# Altium schematic sheet 30_PP0_PWR.SchDoc
size 419 x 296 mm; Author: Serbinov O.A.; CompanyName: ELSICOM; DrawnBy: Serbinov O.A.; Engineer: Serbinov O.A.; Organization: Elsicom; Address1: Kirova avenue, 58; Address2: Tomsk; Address3: Russia 634012; DocumentNumber: 31; SheetNumber: 31; SheetTotal: 44; ProjectName: 48_PORTS
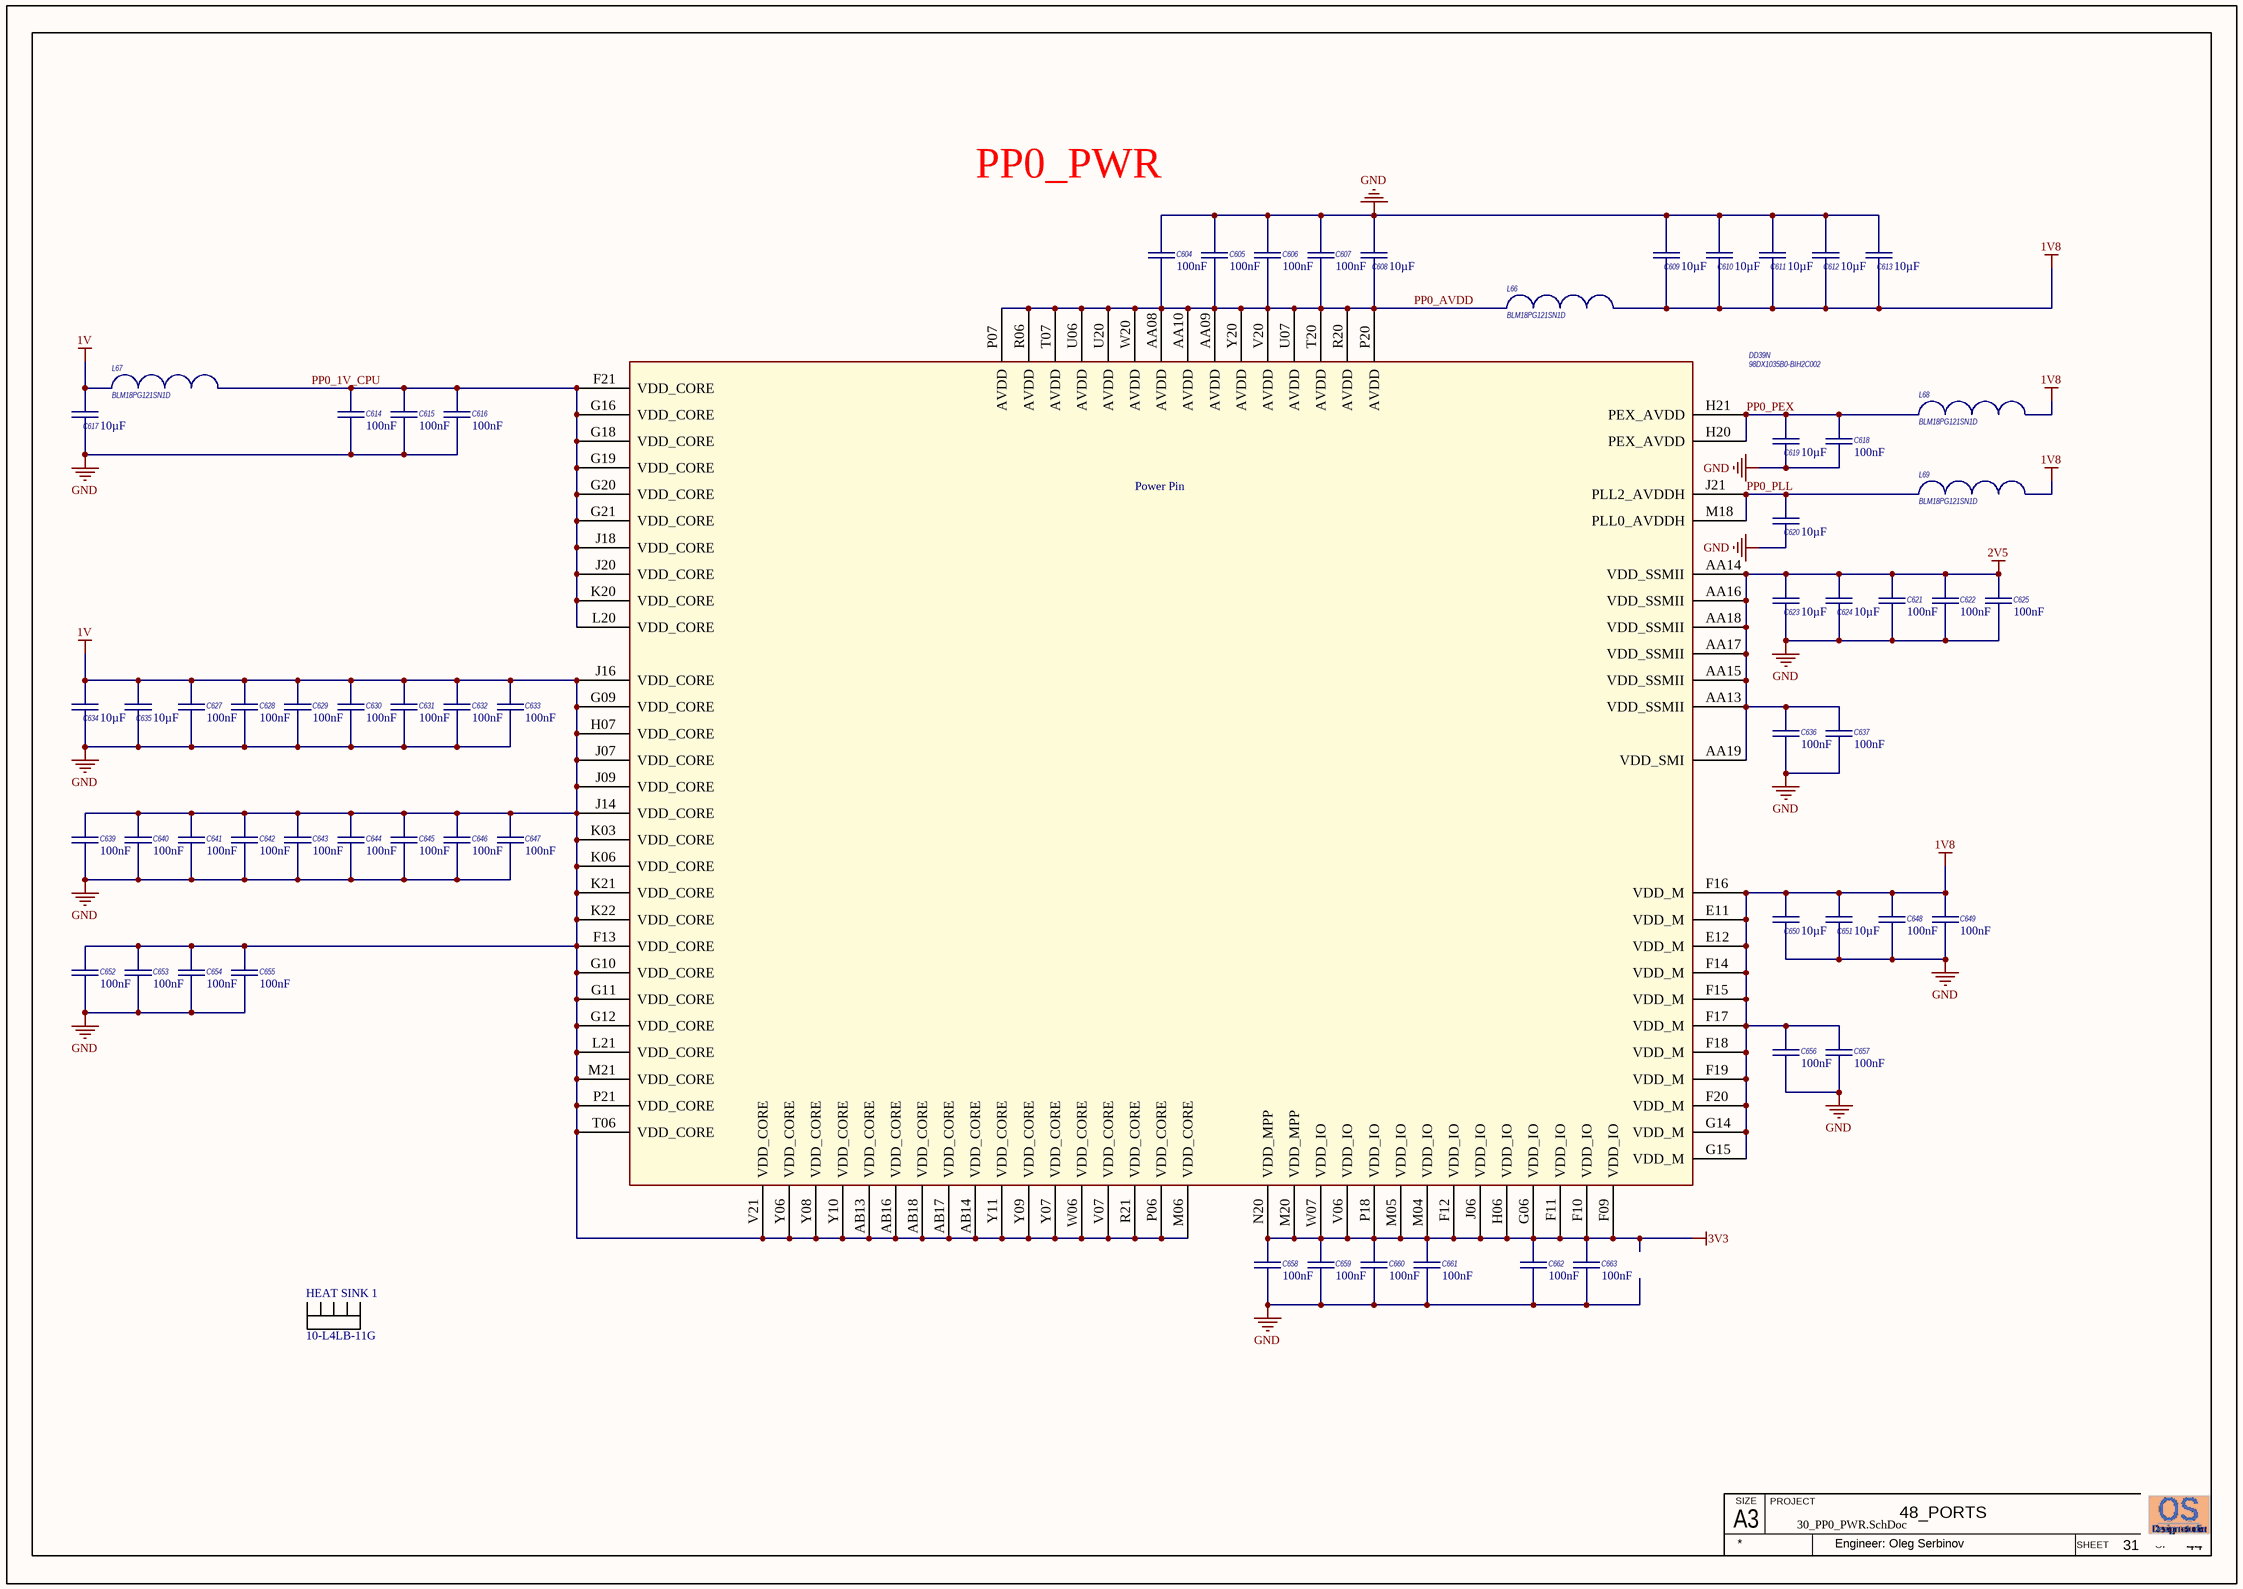
[diagram p0: 30_PP0_PWR.SchDoc]

## Parts
C604  Capacitance: 100nF  [C0402_IPC High Density]  (hidden comment: GRM155R71E104KE14D)
C605  Capacitance: 100nF  [C0402_IPC High Density]  (hidden comment: GRM155R71E104KE14D)
C606  Capacitance: 100nF  [C0402_IPC High Density]  (hidden comment: GRM155R71E104KE14D)
C607  Capacitance: 100nF  [C0402_IPC High Density]  (hidden comment: GRM155R71E104KE14D)
C608  Capacitance: 10µF  [CAPC2012[0805]]  (hidden comment: GRM21BR61C106KE15)
C609  Capacitance: 10µF  [CAPC2012[0805]]  (hidden comment: GRM21BR61C106KE15)
C610  Capacitance: 10µF  [CAPC2012[0805]]  (hidden comment: GRM21BR61C106KE15)
C611  Capacitance: 10µF  [CAPC2012[0805]]  (hidden comment: GRM21BR61C106KE15)
C612  Capacitance: 10µF  [CAPC2012[0805]]  (hidden comment: GRM21BR61C106KE15)
C613  Capacitance: 10µF  [CAPC2012[0805]]  (hidden comment: GRM21BR61C106KE15)
C614  Capacitance: 100nF  [C0402_IPC High Density]  (hidden comment: GRM155R71E104KE14D)
C615  Capacitance: 100nF  [C0402_IPC High Density]  (hidden comment: GRM155R71E104KE14D)
C616  Capacitance: 100nF  [C0402_IPC High Density]  (hidden comment: GRM155R71E104KE14D)
C617  Capacitance: 10µF  [CAPC2012[0805]]  (hidden comment: GRM21BR61C106KE15)
C618  Capacitance: 100nF  [C0402_IPC High Density]  (hidden comment: GRM155R71E104KE14D)
C619  Capacitance: 10µF  [CAPC2012[0805]]  (hidden comment: GRM21BR61C106KE15)
C620  Capacitance: 10µF  [CAPC2012[0805]]  (hidden comment: GRM21BR61C106KE15)
C621  Capacitance: 100nF  [C0402_IPC High Density]  (hidden comment: GRM155R71E104KE14D)
C622  Capacitance: 100nF  [C0402_IPC High Density]  (hidden comment: GRM155R71E104KE14D)
C623  Capacitance: 10µF  [CAPC2012[0805]]  (hidden comment: GRM21BR61C106KE15)
C624  Capacitance: 10µF  [CAPC2012[0805]]  (hidden comment: GRM21BR61C106KE15)
C625  Capacitance: 100nF  [C0402_IPC High Density]  (hidden comment: GRM155R71E104KE14D)
C627  Capacitance: 100nF  [C0402_IPC High Density]  (hidden comment: GRM155R71E104KE14D)
C628  Capacitance: 100nF  [C0402_IPC High Density]  (hidden comment: GRM155R71E104KE14D)
C629  Capacitance: 100nF  [C0402_IPC High Density]  (hidden comment: GRM155R71E104KE14D)
C630  Capacitance: 100nF  [C0402_IPC High Density]  (hidden comment: GRM155R71E104KE14D)
C631  Capacitance: 100nF  [C0402_IPC High Density]  (hidden comment: GRM155R71E104KE14D)
C632  Capacitance: 100nF  [C0402_IPC High Density]  (hidden comment: GRM155R71E104KE14D)
C633  Capacitance: 100nF  [C0402_IPC High Density]  (hidden comment: GRM155R71E104KE14D)
C634  Capacitance: 10µF  [CAPC2012[0805]]  (hidden comment: GRM21BR61C106KE15)
C635  Capacitance: 10µF  [CAPC2012[0805]]  (hidden comment: GRM21BR61C106KE15)
C636  Capacitance: 100nF  [C0402_IPC High Density]  (hidden comment: GRM155R71E104KE14D)
C637  Capacitance: 100nF  [C0402_IPC High Density]  (hidden comment: GRM155R71E104KE14D)
C639  Capacitance: 100nF  [C0402_IPC High Density]  (hidden comment: GRM155R71E104KE14D)
C640  Capacitance: 100nF  [C0402_IPC High Density]  (hidden comment: GRM155R71E104KE14D)
C641  Capacitance: 100nF  [C0402_IPC High Density]  (hidden comment: GRM155R71E104KE14D)
C642  Capacitance: 100nF  [C0402_IPC High Density]  (hidden comment: GRM155R71E104KE14D)
C643  Capacitance: 100nF  [C0402_IPC High Density]  (hidden comment: GRM155R71E104KE14D)
C644  Capacitance: 100nF  [C0402_IPC High Density]  (hidden comment: GRM155R71E104KE14D)
C645  Capacitance: 100nF  [C0402_IPC High Density]  (hidden comment: GRM155R71E104KE14D)
C646  Capacitance: 100nF  [C0402_IPC High Density]  (hidden comment: GRM155R71E104KE14D)
C647  Capacitance: 100nF  [C0402_IPC High Density]  (hidden comment: GRM155R71E104KE14D)
C648  Capacitance: 100nF  [C0402_IPC High Density]  (hidden comment: GRM155R71E104KE14D)
C649  Capacitance: 100nF  [C0402_IPC High Density]  (hidden comment: GRM155R71E104KE14D)
C650  Capacitance: 10µF  [CAPC2012[0805]]  (hidden comment: GRM21BR61C106KE15)
C651  Capacitance: 10µF  [CAPC2012[0805]]  (hidden comment: GRM21BR61C106KE15)
C652  Capacitance: 100nF  [C0402_IPC High Density]  (hidden comment: GRM155R71E104KE14D)
C653  Capacitance: 100nF  [C0402_IPC High Density]  (hidden comment: GRM155R71E104KE14D)
C654  Capacitance: 100nF  [C0402_IPC High Density]  (hidden comment: GRM155R71E104KE14D)
C655  Capacitance: 100nF  [C0402_IPC High Density]  (hidden comment: GRM155R71E104KE14D)
C656  Capacitance: 100nF  [C0402_IPC High Density]  (hidden comment: GRM155R71E104KE14D)
C657  Capacitance: 100nF  [C0402_IPC High Density]  (hidden comment: GRM155R71E104KE14D)
C658  Capacitance: 100nF  [C0402_IPC High Density]  (hidden comment: GRM155R71E104KE14D)
C659  Capacitance: 100nF  [C0402_IPC High Density]  (hidden comment: GRM155R71E104KE14D)
C660  Capacitance: 100nF  [C0402_IPC High Density]  (hidden comment: GRM155R71E104KE14D)
C661  Capacitance: 100nF  [C0402_IPC High Density]  (hidden comment: GRM155R71E104KE14D)
C662  Capacitance: 100nF  [C0402_IPC High Density]  (hidden comment: GRM155R71E104KE14D)
C663  Capacitance: 100nF  [C0402_IPC High Density]  (hidden comment: GRM155R71E104KE14D)
DD39  98DX1035B0-BIH2C002  [HSBGA617_27X27_1MM]  (part N of 16)
HEAT_SINK_1  10-L4LB-11G  [10-L4LB-11G]  (no BOM)
L66  BLM18PG121SN1D  [INDC1608X95N]
L67  BLM18PG121SN1D  [INDC1608X95N]
L68  BLM18PG121SN1D  [INDC1608X95N]
L69  BLM18PG121SN1D  [INDC1608X95N]

## Nets
1V: C617.2 C627.1 C628.1 C629.1 C630.1 C631.1 C632.1 C633.1 C634.2 C635.2 C639.1 C640.1 C641.1 C642.1 C643.1 C644.1 C645.1 C646.1 C647.1 C652.1 C653.1 C654.1 C655.1 DD39.AB13(VDD_CORE) DD39.AB14(VDD_CORE) DD39.AB16(VDD_CORE) DD39.AB17(VDD_CORE) DD39.AB18(VDD_CORE) DD39.F13(VDD_CORE) DD39.G09(VDD_CORE) DD39.G10(VDD_CORE) DD39.G11(VDD_CORE) DD39.G12(VDD_CORE) DD39.H07(VDD_CORE) DD39.J07(VDD_CORE) DD39.J09(VDD_CORE) DD39.J14(VDD_CORE) DD39.J16(VDD_CORE) DD39.K03(VDD_CORE) DD39.K06(VDD_CORE) DD39.K21(VDD_CORE) DD39.K22(VDD_CORE) DD39.L21(VDD_CORE) DD39.M06(VDD_CORE) DD39.M21(VDD_CORE) DD39.P06(VDD_CORE) DD39.P21(VDD_CORE) DD39.R21(VDD_CORE) DD39.T06(VDD_CORE) DD39.V07(VDD_CORE) DD39.V21(VDD_CORE) DD39.W06(VDD_CORE) DD39.Y06(VDD_CORE) DD39.Y07(VDD_CORE) DD39.Y08(VDD_CORE) DD39.Y09(VDD_CORE) DD39.Y10(VDD_CORE) DD39.Y11(VDD_CORE) L67.1
1V8: C609.1 C610.1 C611.1 C612.1 C613.1 C648.1 C649.1 C650.2 C651.2 C656.1 C657.1 DD39.E11(VDD_M) DD39.E12(VDD_M) DD39.F14(VDD_M) DD39.F15(VDD_M) DD39.F16(VDD_M) DD39.F17(VDD_M) DD39.F18(VDD_M) DD39.F19(VDD_M) DD39.F20(VDD_M) DD39.G14(VDD_M) DD39.G15(VDD_M) L66.2 L68.2 L69.2
2V5: C621.1 C622.1 C623.2 C624.2 C625.1 C636.1 C637.1 DD39.AA13(VDD_SSMII) DD39.AA14(VDD_SSMII) DD39.AA15(VDD_SSMII) DD39.AA16(VDD_SSMII) DD39.AA17(VDD_SSMII) DD39.AA18(VDD_SSMII) DD39.AA19(VDD_SMI)
3V3: C658.1 C659.1 C660.1 C661.1 C662.1 C663.1 DD39.F09(VDD_IO) DD39.F10(VDD_IO) DD39.F11(VDD_IO) DD39.F12(VDD_IO) DD39.G06(VDD_IO) DD39.H06(VDD_IO) DD39.J06(VDD_IO) DD39.M04(VDD_IO) DD39.M05(VDD_IO) DD39.M20(VDD_MPP) DD39.N20(VDD_MPP) DD39.P18(VDD_IO) DD39.V06(VDD_IO) DD39.W07(VDD_IO)
GND: C604.1 C605.1 C606.1 C607.1 C608.2 C609.2 C610.2 C611.2 C612.2 C613.2 C614.2 C615.2 C616.2 C617.1 C618.2 C619.1 C620.1 C621.2 C622.2 C623.1 C624.1 C625.2 C627.2 C628.2 C629.2 C630.2 C631.2 C632.2 C633.2 C634.1 C635.1 C636.2 C637.2 C639.2 C640.2 C641.2 C642.2 C643.2 C644.2 C645.2 C646.2 C647.2 C648.2 C649.2 C650.1 C651.1 C652.2 C653.2 C654.2 C655.2 C656.2 C657.2 C658.2 C659.2 C660.2 C661.2 C662.2 C663.2
PP0_1V_CPU: C614.1 C615.1 C616.1 DD39.F21(VDD_CORE) DD39.G16(VDD_CORE) DD39.G18(VDD_CORE) DD39.G19(VDD_CORE) DD39.G20(VDD_CORE) DD39.G21(VDD_CORE) DD39.J18(VDD_CORE) DD39.J20(VDD_CORE) DD39.K20(VDD_CORE) DD39.L20(VDD_CORE) L67.2
PP0_AVDD: C604.2 C605.2 C606.2 C607.2 C608.1 DD39.AA08(AVDD) DD39.AA09(AVDD) DD39.AA10(AVDD) DD39.P07(AVDD) DD39.P20(AVDD) DD39.R06(AVDD) DD39.R20(AVDD) DD39.T07(AVDD) DD39.T20(AVDD) DD39.U06(AVDD) DD39.U07(AVDD) DD39.U20(AVDD) DD39.V20(AVDD) DD39.W20(AVDD) DD39.Y20(AVDD) L66.1
PP0_PEX: C618.1 C619.2 DD39.H20(PEX_AVDD) DD39.H21(PEX_AVDD) L68.1
PP0_PLL: C620.2 DD39.J21(PLL2_AVDDH) DD39.M18(PLL0_AVDDH) L69.1

## Notes on the sheet
- PP0_PWR
- A3
- SIZE
- PROJECT
- SHEET
- OF
- Engineer: Oleg Serbinov
- (in symbol 98DX1035A1-BIH2C002, part N) Power Pin

## Library data of the parts
C604-C607 C614-C616 C618 C621 C622 C625 C627-C633 C636 C637 C639-C649 C652-C663 = GRM155R71E104KE14D: C0402, 100nF, 25V, X7R; Manufacturer: Murata; Rmanufacturer: Yageo  Samsung  TDK  Taiyo Yuden  Kemet; Customer Part Number: Конденсатор, 100n, 0402, 25V, X7R, 10%; Capacitance Tolerance: ± 10%; Voltage Rating: 16; Capacitor Case Style: 0402 [1005 Metric]; Capacitor Terminals: SMD; SVHC: No SVHC (19-Dec-2012); No. of Pins: 2; Reel Quantity: 10000; Tolerance +: 10%; Analogs: any suitable; Manufacturer Part Number: GRM155R71E104KE14D; RoHS: YES; Packaging: Reel; Package / Case: 0402; ComponentLink1URL: http://www.farnell.com/datasheets/4360.pdf; ComponentLink1Description: http://www.farnell.com/datasheets/4360.pdf; Pricing: 10000=0.008593, 30000=0.007991 (GBP); Supplier 1: Farnell; Supplier Part Number 1: 1118151; Stock: 3; Dielectric Characteristic: X7R; Operating Temperature Min: -55; Operating Temperature Max: 125; Operating Temperature Range: -55°C to +125; Series: GRM Hi-Cap; Terminal Type: Surface Mount (SMD, SMT); Tolerance -: 10%; Voltage Rating V DC: 16
C608-C613 C617 C619 C620 C623 C624 C634 C635 C650 C651 = GRM21BR61C106KE15: C0805, 10uF 10%, 16V, X5R; Manufacturer: Murata; Customer Part Number: Конденсатор, 10u, 0805, 16V, X5R, 10%; Analogs: any suitable; Applications: General Purpose; Category: Capacitors; Operating Temperature: -55°C ~ 85°C; Package / Case: 0805 (2012 Metric); Size / Dimension: 0.079" L x 0.049" W (2.00mm x 1.25mm); Temperature Coefficient: X5R; Tolerance: ±10%; ComponentLink1URL: http://search.murata.co.jp/Ceramy/image/img/PDF/ENG/GRM21BR61C106KE15.pdf; ComponentLink1Description: http://search.murata.co.jp/Ceramy/image/img/PDF/ENG/GRM21BR61C106KE15.pdf; Pricing: 1=0.3, 10=0.25, 50=0.1408, 100=0.1252, 250=0.09392, 500=0.08294, 1000=0.07356 (USD); Voltage - Rated: 16V; Manufacturer Part Number: GRM21BR61C106KE15
DD39 = 98DX1035A1-BIH2C002: IC 24-PORT FE  4-PORT 2.5GE L2 ENTRY-LEVEL, CPU; Customer Part Number: Микросхема, 98DX1035B0-BIH2C002, IC 24-PORT FE 4-PORT 2.5GE L2 ENTRY-LEVEL, HSBGA617SBGA617; Manufacturer: Marvell Technology Group; Manufacturer Part Number: 98DX1035B0-BIH2C002
HEAT_SINK_1 = 10-L4LB-11G: HEAT SINK  45.2x41.4; Manufacturer: Aavid Thermalloy; Customer Part Number: Радиатор, 10-L4LB-11G, Pin Fin heat sink with Push Pin attachment; Manufacturer Part Number: 10-L4LB-11G
L66-L69 = BLM18PG121SN1D: FILTER BLM18 (0603, 2A); Manufacturer: Murata; Rpart number: MPZ1608S121ATAH0 ; CIC10P121NC ; MPZ1608S121ATDH5 ; BLM18PG121SH1D ; 742792625; Rmanufacturer: Boruns  Samsung  TDK  Murata  Wurth Electronics; Customer Part Number: Дроссель, BLM18PG121SN1D, FERRITE BEAD 120 OHM 1LN, 0603; DC Resistance Max: 0.05; Impedance: 120; Ferrite Mounting: SMD; Inductor Type: Ferrite Bead; SVHC: No SVHC (19-Dec-2011); Ferrite Case Style: 0603 / 1608; Core Material: Ferrite; DC Current Max: 2000; Inductor Case Style: 0603; Inductance Tolerance: ± 25%; No. of Pins: 2; RoHS: YES; Operating Temperature Min: -55; Mounting Type: SMD; Operating Temperature Max: +125; Package / Case: 0603; Impedance @ 100MHz Typ: 120; Resistance: 0.05; Supplier Part Number: 1515738; Supplier: Farnell; ComponentLink1URL: http://www.farnell.com/datasheets/5148.pdf; ComponentLink1Description: http://www.farnell.com/datasheets/5148.pdf; Pricing: 5=0.056, 50=0.041, 100=0.034, 250=0.028, 500=0.027 (GBP); Manufacturer Part Number: BLM18PG121SN1D; DC Current Rating: 2A; Analogs: MPZ1608S121ATAH0 ; CIC10P121NC ; MPZ1608S121ATDH5 ; BLM18PG121SH1D ; 742792625